# EAGLE design PortBreakoutCapacitive_r4 (EAGLE 9.6.2)
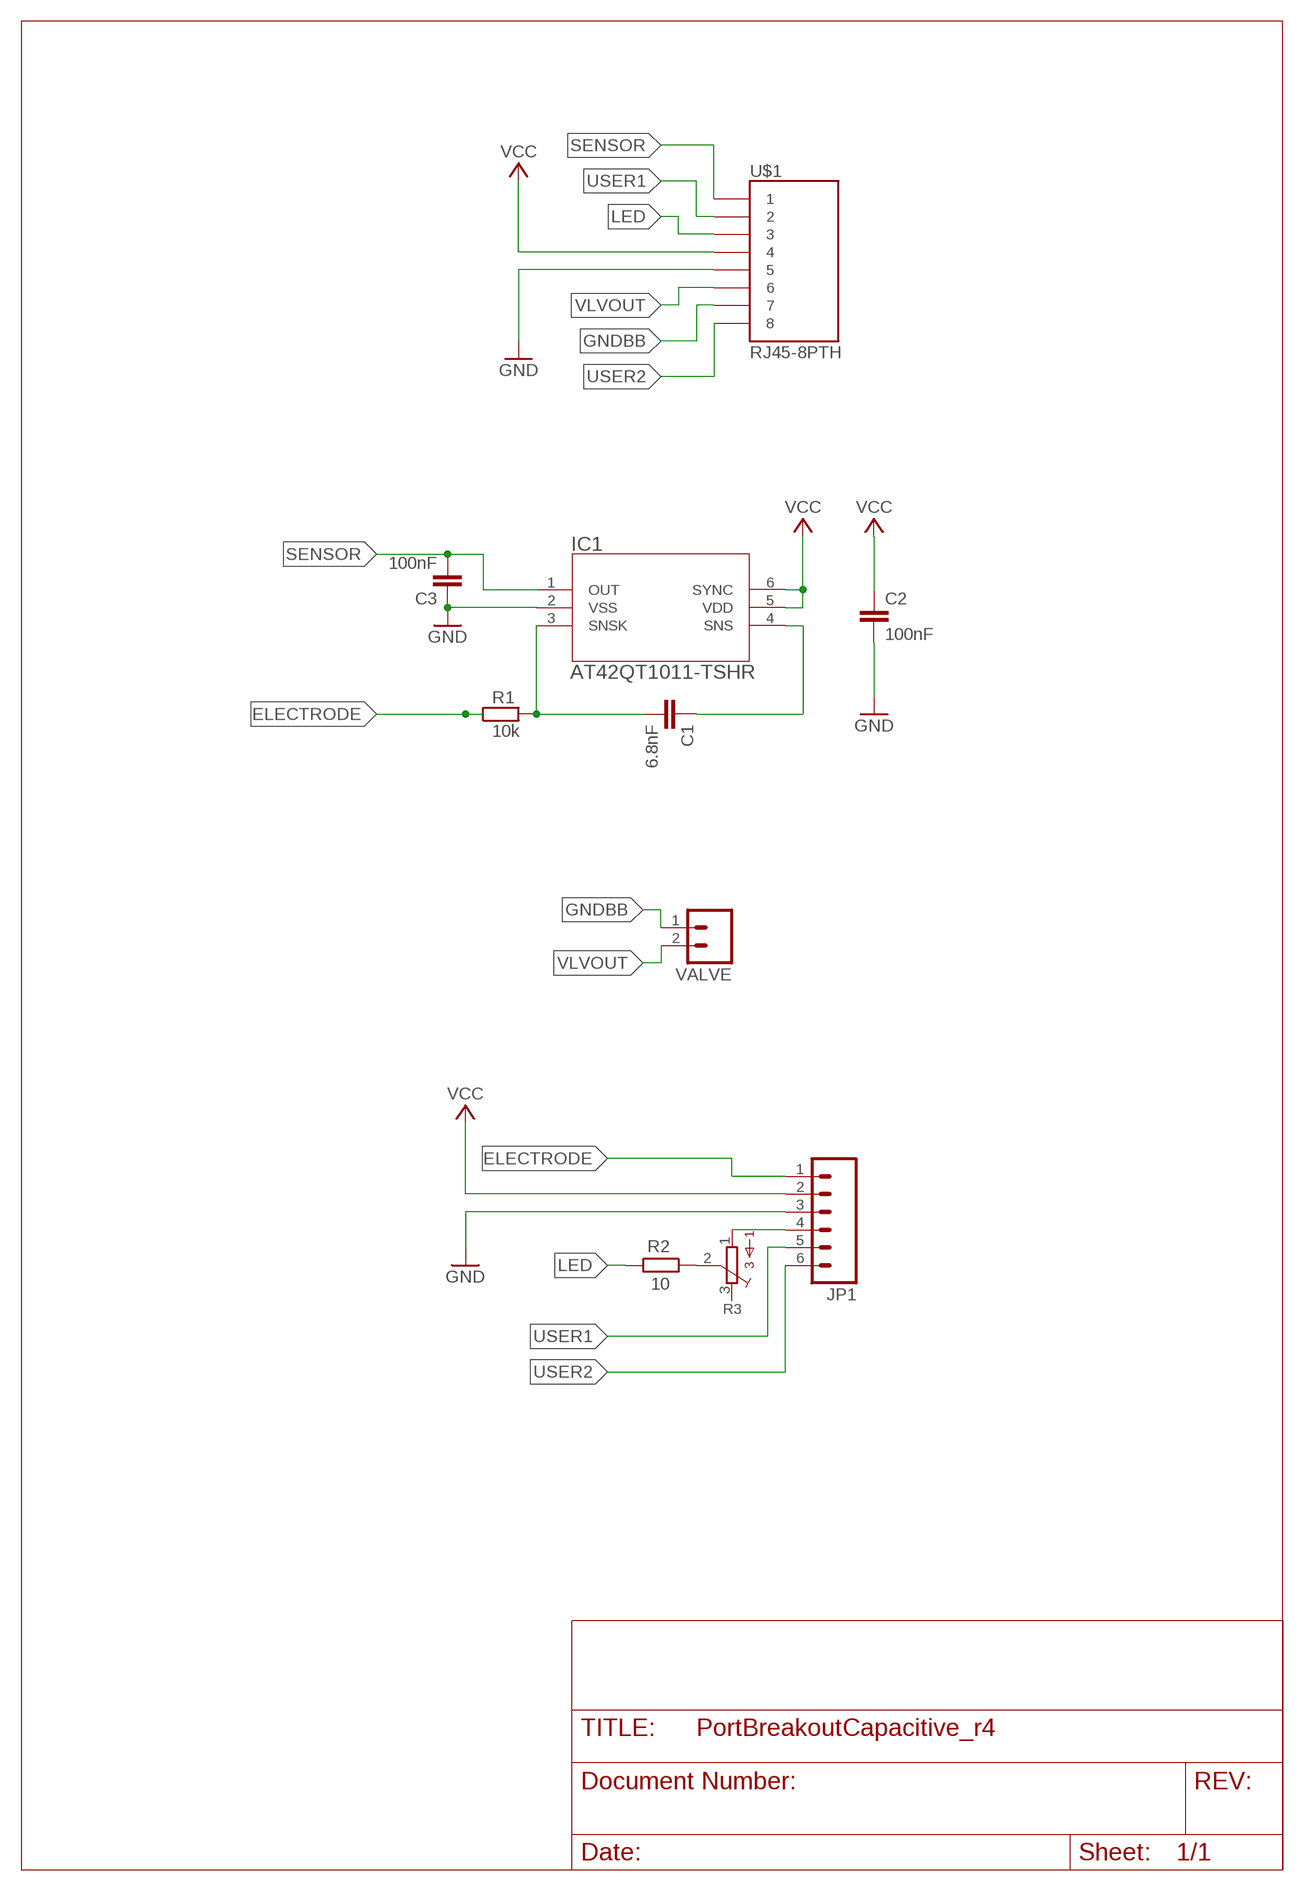
[diagram p0: schematic, sheet 1]

## Parts
C1  6.8nF  C-EUC1206  [C1206]
C2  100nF  C-EUC1206  [C1206]
C3  100nF  C-EUC1206  [C1206]
IC1  AT42QT1011-TSHR  AT42QT1010-TSHR  [6ST1_ATM]
JP1  M063.5MM-6  [SCREWTERMINAL-3.5MM-6]
R1  10k  R-EU_R1206  [R1206]
R2  10  R-EU_R1206  [R1206]
R3  3362R  [3362R]
U$1  RJ45-8PTH  [RJ45-8]
VALVE  M023.5MM_LOCK  [SCREWTERMINAL-3.5MM-2_LOCK]

## Nets
ELECTRODE: JP1.1 R1.1
GND: C2.2 C3.1 IC1.2(VSS) JP1.3 U$1.5
GNDBB: U$1.7 VALVE.1
LED: R2.2 U$1.3
N$4: R2.1 R3.2
N$7: JP1.4 R3.1
SENSOR: C3.2 IC1.1(OUT) U$1.1
SNS: C1.1 IC1.4(SNS)
SNSK: C1.2 IC1.3(SNSK) R1.2
USER1: JP1.5 U$1.2
USER2: JP1.6 U$1.8
VCC: C2.1 IC1.5(VDD) IC1.6(SYNC) JP1.2 U$1.4
VLVOUT: U$1.6 VALVE.2
Unconnected: R3.3

## Library data of the parts
C1-C3 = rcl:C-EU: CAPACITOR, European symbol; SPICEPREFIX: C
IC1 = flo:AT42QT1010-TSHR; BUILT_BY: EMA_UL_Team; MANUFACTURER_PART_NUMBER: AT42QT1010-TSHR; SOURCELIBRARY: Atmel_2011-04-02; VENDOR: Atmel
JP1 = SparkFun:M06: Header 6 Standard 6-pin 0.1" header. Use with straight break away headers (SKU : PRT-00116), right angle break away headers (PRT-00553), swiss pins (PRT-00743), machine pins (PRT-00117), and female headers (PRT-00115). Molex polarized connector foot print use with SKU : PRT-08094 with associated crimp pins and housings. NOTES ON THE VARIANTS LOCK and LOCK_LONGPADS... This footprint was designed to help hold the alignment of a through-hole component (i.e. 6-pin header) while soldering it into place. You may notice that each hole has been shifted either up or down by 0.005 of an inch from it's more standard position (which is a perfectly straight line). This slight alteration caused the pins (the squares in the middle) to touch the edges of the holes. Because they are alternating, it causes a "brace" to hold the component in place. 0.005 has proven to be the perfect amount of "off-center" position when using our standard breakaway headers. Although looks a little odd when you look at the bare footprint, once you have a header in there, the alteration is very hard to notice. Also, if you push a header all the way into place, it is covered up entirely on the bottom side. This idea of altering the position of holes to aid alignment will be further integrated into the Sparkfun Library for other footprints. It can help hold any component with 3 or more connection pins.
R1 R2 = rcl:R-EU_: RESISTOR, European symbol; SPICEPREFIX: R
R3 = bourns:3362: 3362 Series 1/4" Square Trimmer
U$1 = SparkFun:RJ45-8: RJ45 Jack Simple RJ45, 8-pin connection - connector for common Cat5, Cat5e, and Cat6 Ethernet cables. Footprint not yet proven in production. Connector sku is PRT-00643; Breakout PCB sku is BOB-00716.
VALVE = SparkFun:M02: Header 2 Standard 2-pin 0.1" header. Use with straight break away headers (SKU : PRT-00116), right angle break away headers (PRT-00553), swiss pins (PRT-00743), machine pins (PRT-00117), and female headers (PRT-00115). Molex polarized connector foot print use with SKU : PRT-08233 with associated crimp pins and housings.

## Board
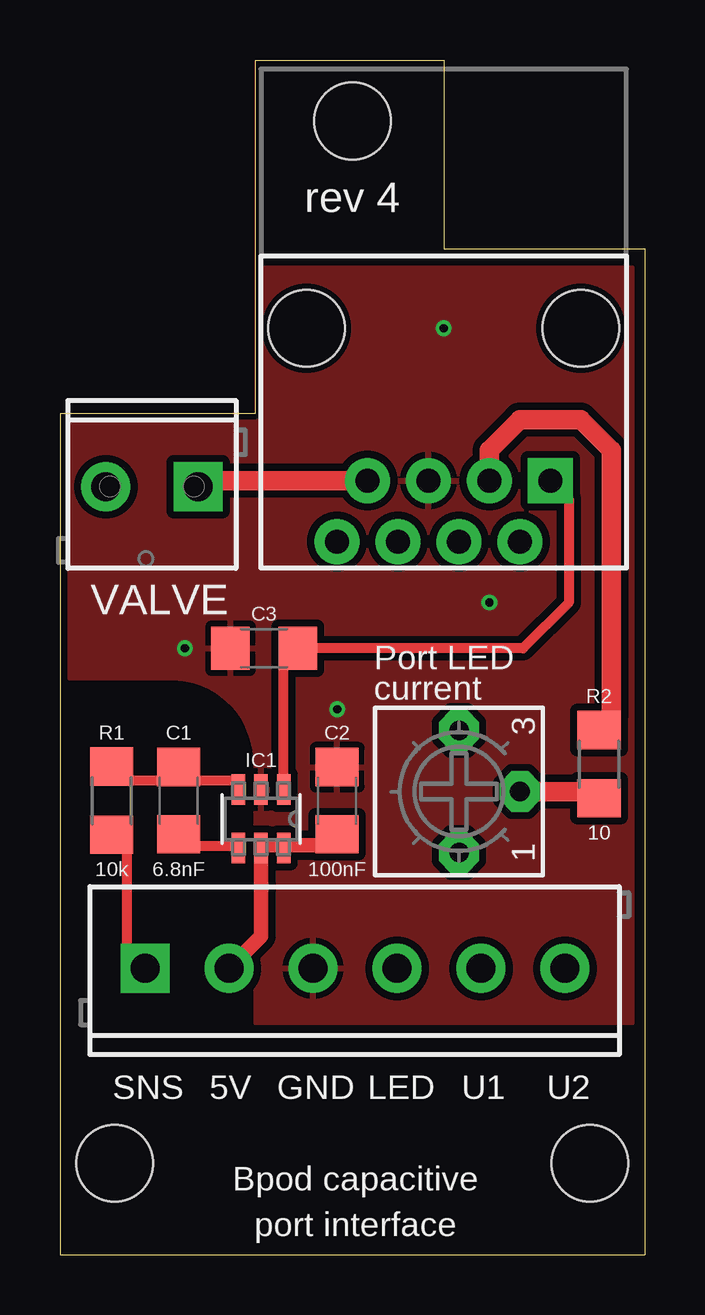
[diagram p1: board, top side]
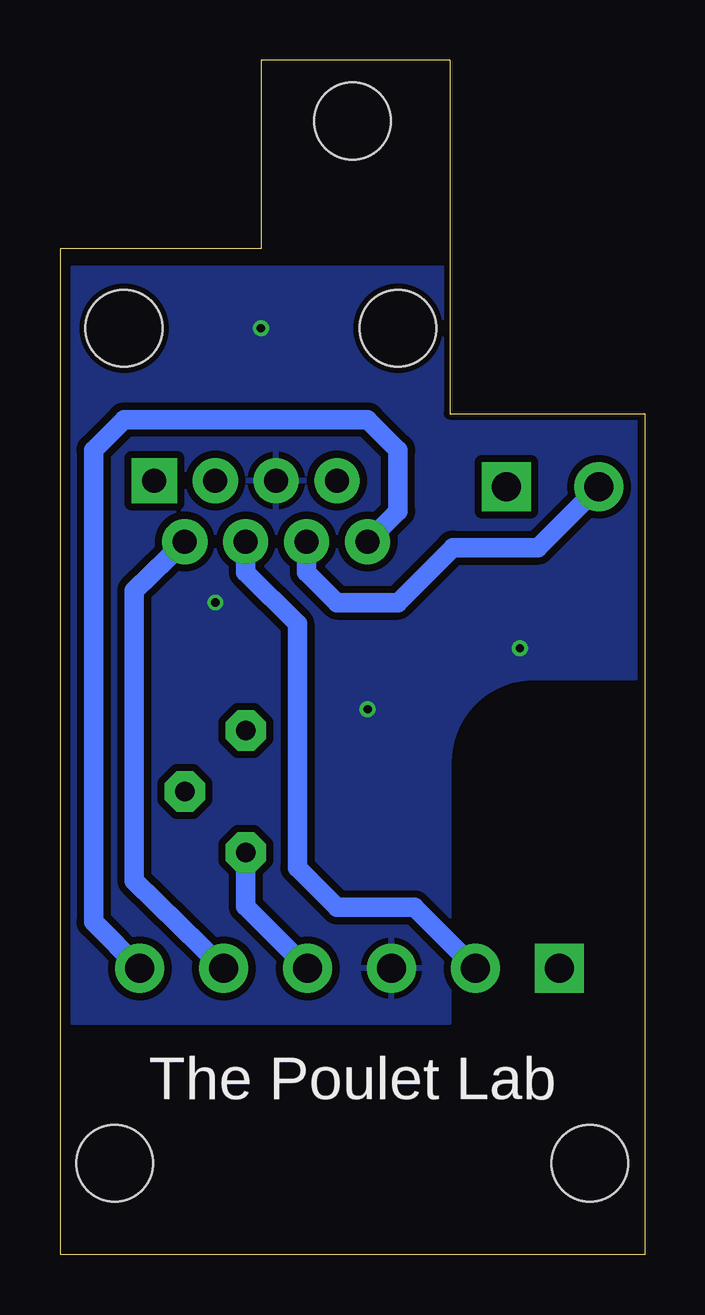
[diagram p2: board, bottom side, seen from below]

Size 24.38 x 49.78 mm. Coordinates in mm from the lower left corner, seen from the top.
Outline: 0,0 24.38,0 24.38,41.91 16,41.91 16,49.78 8.13,49.78 8.13,35.05 0,35.05 0,0
Copper layers (1*16): Top 0.035mm / dielectric 1.5mm / Bottom 0.035mm
Design rules "SeeedStudio_2layer_DRU_no_angle_20140221 *": minimum track width 6mil, minimum drill 12mil, track to track 12mil, track to pad 12mil, pad to pad 12mil, via to via 12mil, smd to smd 0mil, copper to edge 10mil, drill to drill 10mil, minimum pad ring 10mil, minimum via ring 6mil, stop-mask expansion 2mil, vias tented up to drill 100mil, thermal gap 10mil
Holes 3.2 mm at 12.19,47.24 22.1,3.81 2.29,3.81

### Footprints (pad centres in the part's own frame; a part is rotated, then mirrored left to right if it is on the bottom)
C1206 = smd 1.6 x 1.8: 1 -1.4,0; 2 1.4,0
6ST1_ATM = smd 1.27 x 0.559: 1 -1.219,0.95; 2 -1.219,0; 3 -1.219,-0.95; 4 1.219,-0.95; 5 1.219,0; 6 1.219,0.95
SCREWTERMINAL-3.5MM-6 = drill 1.2 pad 2.032 square: 1 0,0 | drill 1.2 pad 2.032: 2 3.5,0; 3 7,0; 4 10.5,0; 5 14,0; 6 17.5,0
R1206 = smd 1.6 x 1.803: 1 -1.422,0; 2 1.422,0
3362R = drill 0.813 pad 1.676 octagon: 1 -2.54,0; 2 0,-2.54; 3 2.54,0
RJ45-8 = drill 1 pad 1.88 square: 1 -4.445,6.35 | drill 1 pad 1.88: 2 -3.175,8.89; 3 -1.905,6.35; 4 -0.635,8.89; 5 0.635,6.35; 6 1.905,8.89; 7 3.175,6.35; 8 4.445,8.89 | hole 3.2: -5.715,0; 5.715,0
SCREWTERMINAL-3.5MM-2_LOCK = drill 1.2 pad 2.032 square: 1 -0.178,0 | drill 1.2 pad 2.032: 2 3.678,0

### Placement (x,y rotation side)
C1  4.95,18.92 90 top
C2  11.56,18.92 90 top
C3  8.51,25.27 0 top
IC1  8.38,18.16 270 top
JP1  3.56,11.94 0 top
R1  2.16,18.92 90 top
R2  22.48,20.45 90 top
R3  16.64,19.3 90 top
U$1  16,38.61 180 top
VALVE  5.59,32 180 top

### Tracks (layer width: path | path; a pad name or v marks a point on that pad's centre or on a via)
ELECTRODE
  Top 0.406: R1.1 2.79,16.87 2.79,12.7 JP1.1
GND  (via drill 0.35)
  other vias: 16,38.61 11.56,22.73 5.21,25.27 17.91,27.18
  pour Bottom: 0.38,41.15 0.38,24 4.61,24 arc-90 8.13,20.49 8.13,9.65 23.88,9.65 23.88,41.15
  pour Top: 8.13,20.53 8.13,9.65 23.88,9.65 23.88,41.15 0.38,41.15 0.38,24 4.65,24 arc-90
GNDBB
  Top 0.813: U$1.7 6.02,32.26 VALVE.1
LED
  Top 0.813: R2.2 22.99,22.38 22.99,33.53 21.72,34.8 19.18,34.8 17.91,33.53 U$1.3
N$4
  Top 0.813: R2.1 22.2,19.3 R3.2
N$7
  Bottom 0.813: R3.1 16.64,14.52 JP1.4
SENSOR
  Top 0.406: U$1.1 21.21,31.5 21.21,27.18 19.3,25.27 C3.2 9.33,25.49 IC1.1
SNS
  Top 0.406: IC1.4 7.36,17.02 4.95,17.02 C1.1
SNSK
  Top 0.406: C1.2 4.95,19.76 | 4.95,19.76 2.16,19.76 R1.2 | IC1.3 7.43,19.76 4.95,19.76
USER1
  Bottom 0.61: U$1.2
  Bottom 0.813: U$1.2 21.29,27.67 21.29,15.6 JP1.5
USER2
  Bottom 0.813: U$1.8 10.29,30.99 10.29,33.53 11.56,34.8 21.72,34.8 22.99,33.53 22.99,13.87 JP1.6
VCC
  Top 0.61: 9.33,17.07 8.38,17.07 IC1.5 8.38,13.26 JP1.2 | C2.1 11.1,17.07 9.33,17.07 | 9.33,17.07 IC1.6
  Bottom 0.813: U$1.4 16.64,28.45 14.48,26.29 14.48,16.13 12.83,14.48 9.6,14.48 JP1.2
VLVOUT
  Bottom 0.813: U$1.6 14.1,28.45 12.83,27.18 10.29,27.18 8.01,29.46 4.45,29.46 VALVE.2

### Text on the board
tPlace: rev 4 | Port LED | current | SNS | 5V | GND | LED | U1 | U2 | Bpod capacitive | port interface
bNames: The Poulet Lab
Measures: Dimensions given are in inches.